# EAGLE design switchboard_eurobotics2010_r2 (EAGLE 4.16)
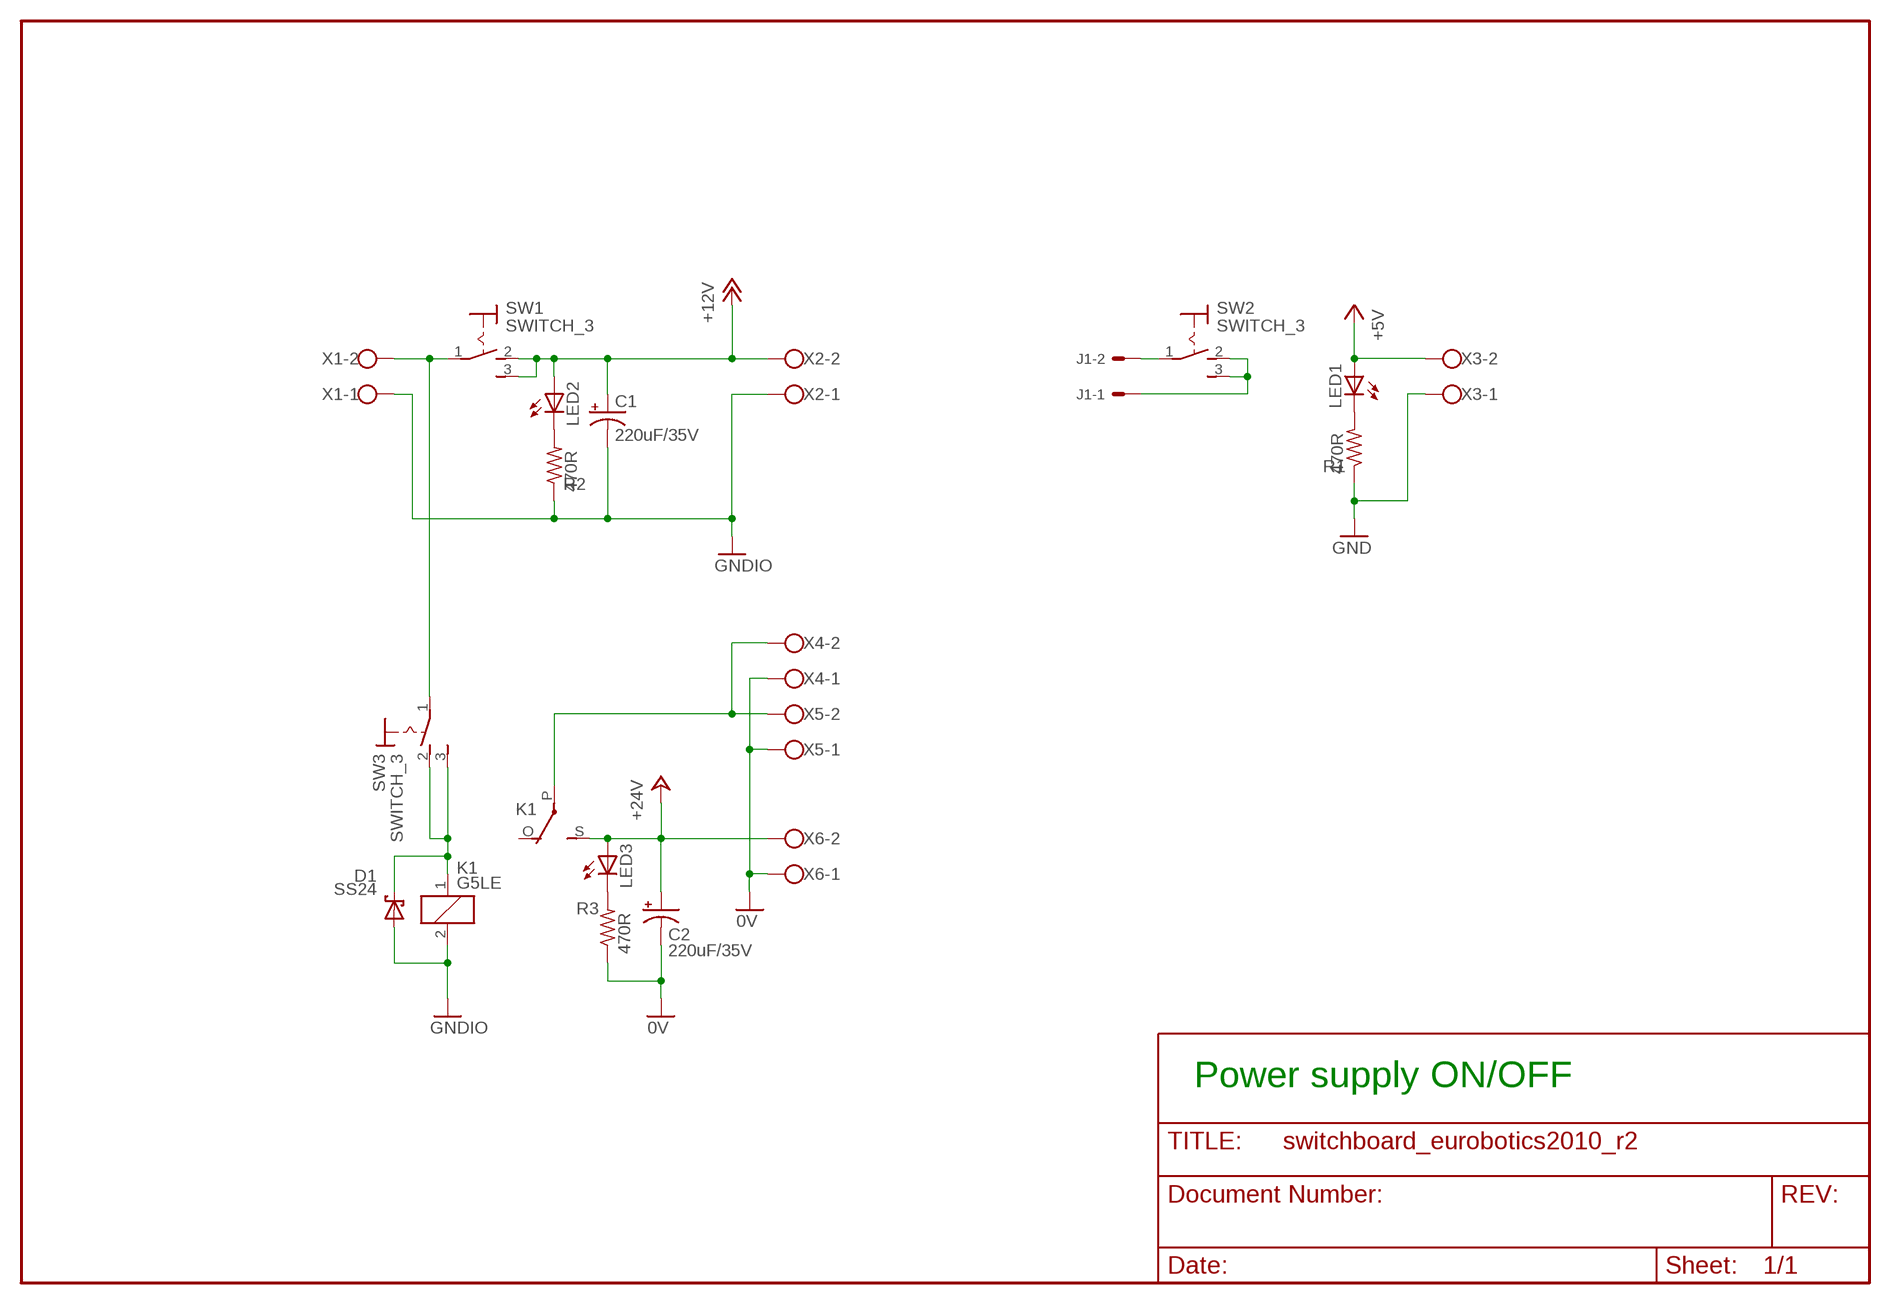
[diagram p0: schematic, sheet 1]

## Parts
C1  220uF/35V  CPOL-USE5-10.5  [E5-10,5]
C2  220uF/35V  CPOL-USE5-10.5  [E5-10,5]
D1  SS24  SCHOTTKY_SMB  [DIOM5436X265N]
J1  22-27-2021-02  [6410-02]
K1  G5LE  [G5LE]
LED1  LED3MM  [LED3MM]
LED2  LED3MM  [LED3MM]
LED3  LED3MM  [LED3MM]
R1  470R  R-US_R0805  [R0805]
R2  470R  R-US_R0805  [R0805]
R3  470R  R-US_R0805  [R0805]
SW1  SWITCH_3  [ROCKER_SWITCH]
SW2  SWITCH_3  [ROCKER_SWITCH]
SW3  SWITCH_3  [ROCKER_SWITCH]
X1  W237-02P  [W237-132]
X2  W237-02P  [W237-132]
X3  W237-02P  [W237-132]
X4  W237-02P  [W237-132]
X5  W237-02P  [W237-132]
X6  W237-02P  [W237-132]

## Nets
0V: C2.- R3.1 X4.1 X5.1 X6.1
+5V: LED1.A X3.2
+12V: C1.+ LED2.A SW1.2 SW1.3 X2.2
+24V: C2.+ K1.S(2:S) LED3.A X6.2
+24VIN: K1.P(2:P) X4.2 X5.2
GND: R1.1 X3.1
GNDIO: C1.- D1.A K1.2 R2.1 X1.1 X2.1
N$1: SW1.1 SW3.1 X1.2
N$2: J1.2 SW2.1
N$3: D1.K K1.1 SW3.2 SW3.3
N$4: J1.1 SW2.2 SW2.3
N$6: LED2.K(C) R2.2
N$7: LED1.K(C) R1.2
N$8: LED3.K(C) R3.2
Unconnected: K1.O(2:O)

## Notes on the sheet
- Power supply ON/OFF

## Library data of the parts
C1 C2 = rcl:CPOL-US: POLARIZED CAPACITOR, American symbol
D1 = ipc-7351-diode:SCHOTTKY_
J1 = con-molex:22-?-02: CONNECTOR wire to board 2.54 mm (.1 inch) pitch header
K1 = relay:G5LE: RELAY 1 x switch, 10 A/120 V AC, 8 A/30 V DC, Omron
LED1-LED3 = led:LED: LED OSRAM: - CHIPLED LG R971, LG N971, LY N971, LG Q971, LY Q971, LO R971, LY R971 LH N974, LH R974 LS Q976, LO Q976, LY Q976 LO Q996 - Hyper CHIPLED LW Q18S LB Q993, LB Q99A, LB R99A - SideLED LS A670, LO A670, LY A670, LG A670, LP A670 LB A673, LV A673, LT A673, LW A673 LH A674 LY A675 LS A676, LA A676, LO A676, LY A676, LW A676 LS A679, LY A679, LG A679 - Hyper Micro SIDELED® LS Y876, LA Y876, LO Y876, LY Y876 LT Y87S - SmartLED LW L88C, LW L88S LB L89C, LB L89S, LG L890 LS L89K, LO L89K, LY L89K LS L896, LA L896, LO L896, LY L896 - TOPLED LS T670, LO T670, LY T670, LG T670, LP T670 LSG T670, LSP T670, LSY T670, LOP T670, LYG T670 LG T671, LOG T671, LSG T671 LB T673, LV T673, LT T673, LW T673 LH T674 LS T676, LA T676, LO T676, LY T676, LB T676, LH T676, LSB T676, LW T676 LB T67C, LV T67C, LT T67C, LS T67K, LO T67K, LY T67K, LW E67C LS E67B, LA E67B, LO E67B, LY E67B, LB E67C, LV E67C, LT E67C LW T67C LS T679, LY T679, LG T679 LS T770, LO T770, LY T770, LG T770, LP T770 LB T773, LV T773, LT T773, LW T773 LH T774 LS E675, LA E675, LY E675, LS T675 LS T776, LA T776, LO T776, LY T776, LB T776 LHGB T686 LT T68C, LB T68C - Hyper Mini TOPLED® LB M676 - Mini TOPLED Santana® LG M470 LS M47K, LO M47K, LY M47K Source: http://www.osram.convergy.de/
R1-R3 = rcl:R-US_: RESISTOR, American symbol
SW1-SW3 = temp_eagle_lib:SWITCH_3
X1-X6 = con-wago-508:W237-02P: WAGO SREW CLAMP

## Board
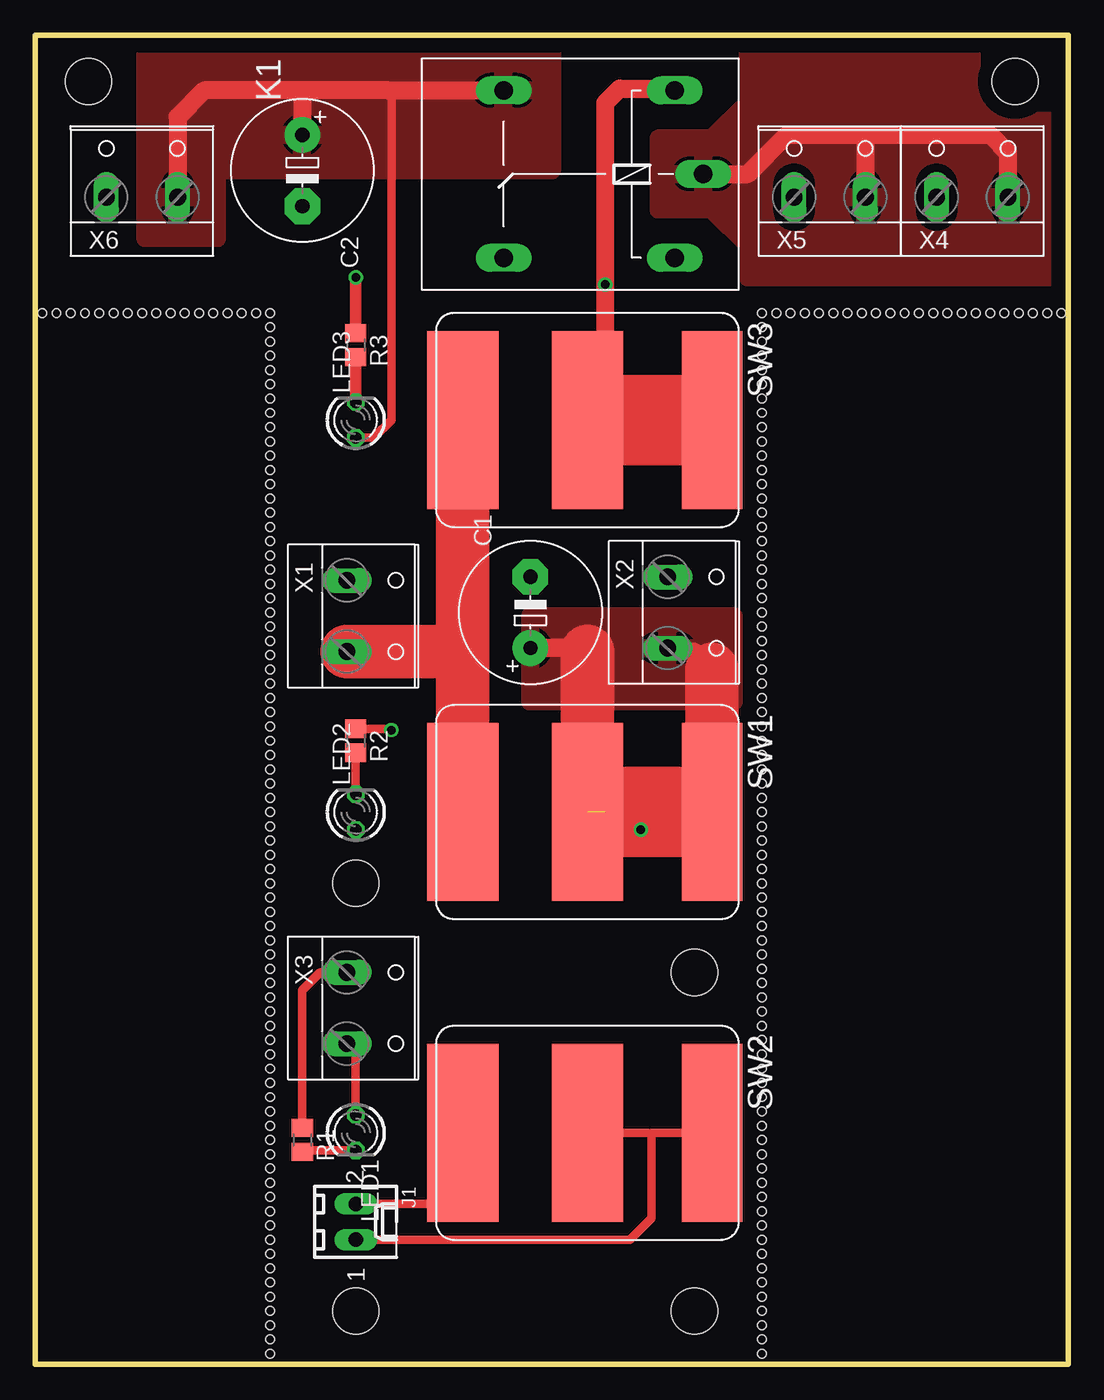
[diagram p1: board, top side]
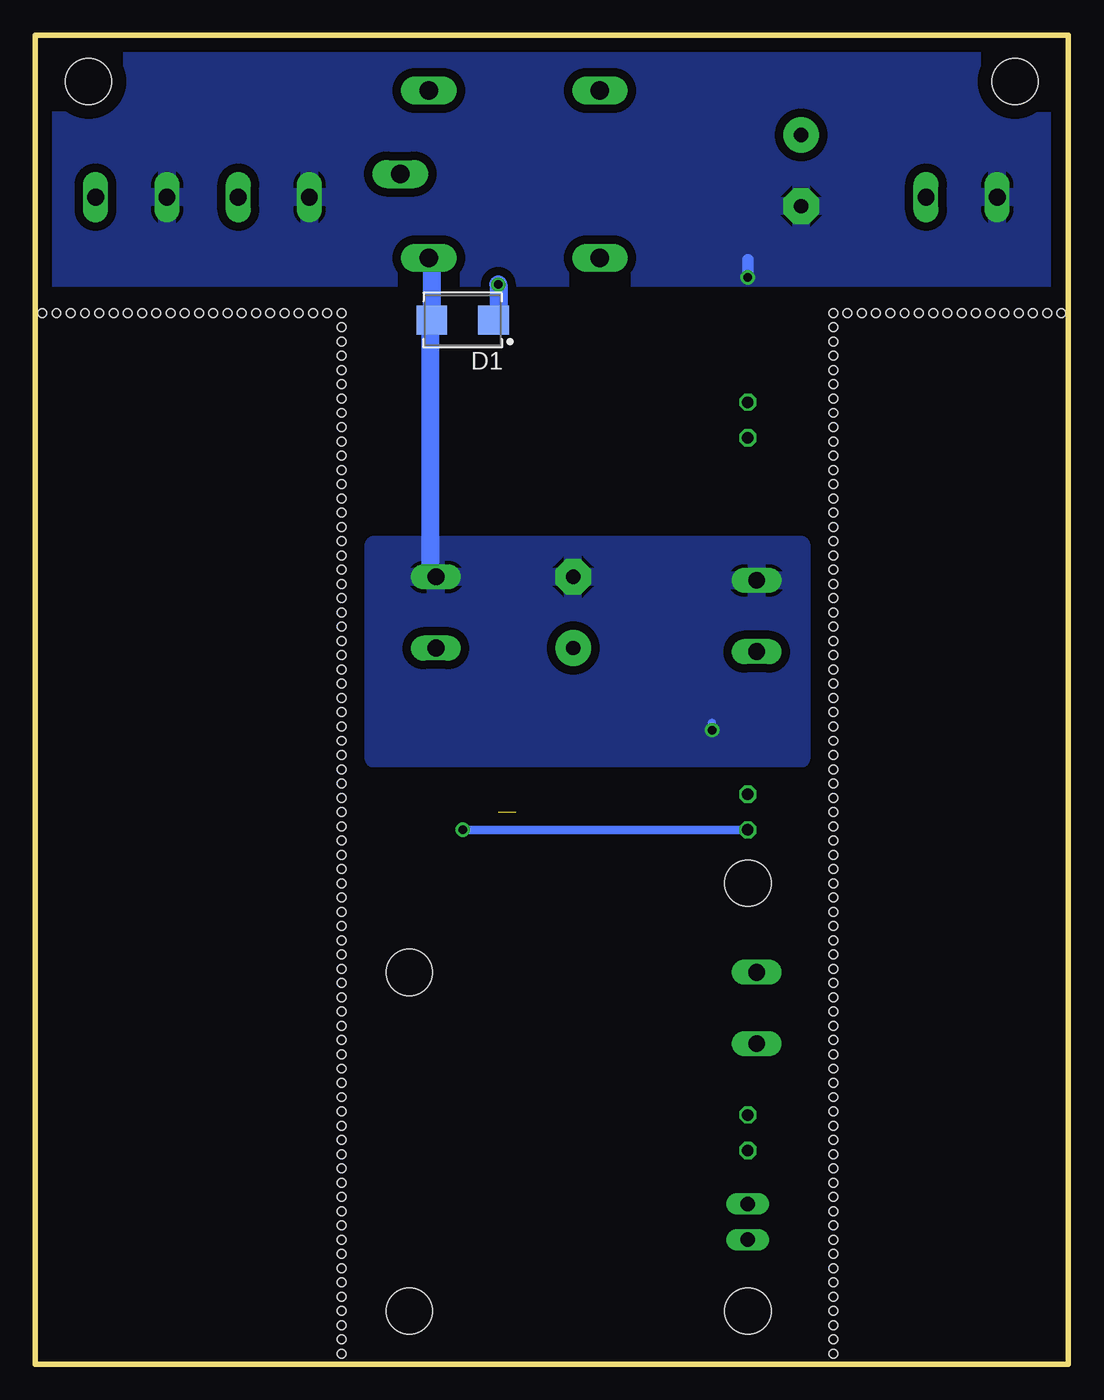
[diagram p2: board, bottom side, seen from below]

Size 73.66 x 94.74 mm. Coordinates in mm from the lower left corner, seen from the top.
Outline: 0,94.74 73.66,94.74 73.66,0 0,0 0,94.74
Copper layers (1*16): Top 0.035mm / dielectric 1.5mm / Bottom 0.035mm
Design rules "olimex": minimum track width 10mil, minimum drill 24mil, track to track 8mil, track to pad 8mil, pad to pad 8mil, via to via 8mil, smd to smd 8mil, copper to edge 40mil, drill to drill 8mil, minimum pad ring 8mil, minimum via ring 8mil, stop-mask expansion 4mil, vias tented up to drill 0mil, thermal gap 10mil
Holes 3.3 mm at 69.85,91.44 3.81,91.44 22.86,34.29 46.99,3.81 46.99,27.94 22.86,3.81
Holes 0.61 mm at 2.54,74.93 3.56,74.93 4.57,74.93 5.59,74.93 6.6,74.93 7.62,74.93 8.64,74.93 9.65,74.93 10.67,74.93 11.68,74.93 12.7,74.93 13.72,74.93 14.73,74.93 15.75,74.93 16.76,74.93 16.76,73.91 16.76,72.9 1.52,74.93 16.76,71.88 73.15,74.93 72.14,74.93 71.12,74.93 70.1,74.93 69.09,74.93 68.07,74.93 67.06,74.93 66.04,74.93 65.02,74.93 16.76,60.71 16.76,61.72 16.76,62.74 16.76,63.75 16.76,64.77 16.76,65.79 16.76,66.8 16.76,67.82 16.76,68.83 16.76,69.85 16.76,70.87 16.76,59.69 16.76,48.51 16.76,49.53 16.76,50.55 16.76,51.56 16.76,52.58 16.76,53.59 16.76,54.61 16.76,55.63 16.76,56.64 16.76,57.66 16.76,58.67 16.76,47.5 16.76,36.32 16.76,37.34 16.76,38.35 16.76,39.37 16.76,40.39 16.76,41.4 16.76,42.42 16.76,43.43 16.76,44.45 16.76,45.47 16.76,46.48 16.76,35.31 16.76,24.13 16.76,25.15 16.76,26.16 16.76,27.18 16.76,28.19 16.76,29.21 16.76,30.23 16.76,31.24 16.76,32.26 16.76,33.27 16.76,34.29 16.76,23.11 16.76,11.94 16.76,12.95 16.76,13.97 16.76,14.99 16.76,16 16.76,17.02 16.76,18.03 16.76,19.05 16.76,20.07 16.76,21.08 16.76,22.1 16.76,10.92 16.76,0.76 16.76,1.78 16.76,2.79 16.76,3.81 16.76,4.83 16.76,5.84 16.76,6.86 16.76,7.87 16.76,8.89 16.76,9.91 51.82,74.93 51.82,73.91 51.82,72.9 51.82,71.88 51.82,60.71 51.82,61.72 51.82,62.74 51.82,63.75 51.82,64.77 51.82,65.79 51.82,66.8 51.82,67.82 51.82,68.83 51.82,69.85 51.82,70.87 51.82,59.69 51.82,48.51 51.82,49.53 51.82,50.55 51.82,51.56 51.82,52.58 51.82,53.59 51.82,54.61 51.82,55.63 51.82,56.64 51.82,57.66 51.82,58.67 51.82,47.5 51.82,36.32 51.82,37.34 51.82,38.35 51.82,39.37 51.82,40.39 51.82,41.4 51.82,42.42 51.82,43.43 51.82,44.45 51.82,45.47 51.82,46.48 51.82,35.31 51.82,24.13 51.82,25.15 51.82,26.16 51.82,27.18 51.82,28.19 51.82,29.21 51.82,30.23 51.82,31.24 51.82,32.26 51.82,33.27 51.82,34.29 51.82,23.11 51.82,11.94 51.82,12.95 51.82,13.97 51.82,14.99 51.82,16 51.82,17.02 51.82,18.03 51.82,19.05 51.82,20.07 51.82,21.08 51.82,22.1 51.82,10.92 51.82,0.76 51.82,1.78 51.82,2.79 51.82,3.81 51.82,4.83 51.82,5.84 51.82,6.86 51.82,7.87 51.82,8.89 51.82,9.91 0.51,74.93 62.99,74.93 61.98,74.93 60.96,74.93 59.94,74.93 58.93,74.93 57.91,74.93 56.9,74.93 55.88,74.93 54.86,74.93 53.85,74.93 52.83,74.93 64.01,74.93

### Footprints (pad centres in the part's own frame; a part is rotated, then mirrored left to right if it is on the bottom)
E5-10,5 = drill 1.016 pad 2.54 round: + -2.54,0 | drill 1.016 pad 2.54 octagon: - 2.54,0
DIOM5436X265N = smd 2.2 x 2.05: A 2.2,0; K -2.2,0
6410-02 = drill 1.016 long: 1 1.27,0; 2 -1.27,0
G5LE = drill 1.321 long: 1 -7.493,-5.969; 2 -7.493,5.969; O 4.699,5.969; P -9.525,0; S 4.699,-5.969
LED3MM = drill 0.813 octagon: A -1.27,0; K 1.27,0
R0805 = smd 1.3 x 1.5: 1 -0.85,0; 2 0.85,0
ROCKER_SWITCH = smd 12.7 x 5.08: 1 0,-8.89; 2 0,0 | smd 12.7 x 4.318: 3 0,8.89
W237-132 = drill 1.194 long: 1 -2.54,-0.635; 2 2.54,-0.635

### Placement (x,y rotation side)
C1  35.31,53.59 90 top
C2  19.05,85.09 270 top
D1  43.18,74.42 180 bottom
J1  22.86,10.16 270 top
K1  38.1,84.84 180 top
LED1  22.86,16.51 270 top
LED2  22.86,39.37 90 top
LED3  22.86,67.31 90 top
R1  19.05,16 270 top
R2  22.86,44.45 270 top
R3  22.86,72.64 270 top
SW1  39.37,39.37 270 top
SW2  39.37,16.51 270 top
SW3  39.37,67.31 270 top
X1  22.86,53.34 270 top
X2  45.72,53.59 270 top
X3  22.86,25.4 270 top
X4  66.8,83.82 0 top
X5  56.64,83.82 0 top
X6  7.62,83.82 0 top

### Tracks (layer width: path | path; a pad name or v marks a point on that pad's centre or on a via)
0V  (via drill 0.61)
  Top 0.813: R3.1 v22.86,77.47
  Bottom 0.813: v22.86,77.47 22.86,78.74
  pour Bottom (isolate 0.61): 74.93,77.47 -1.27,77.47 -1.27,96.52 74.93,96.52
+5V
  Top 0.61: LED1.A 22.86,22.86 X3.2 22.1,22.86
+12V  (via drill 0.61)  (1 unrouted)
  Top 0.61: v43.18,38.1 43.18,39.37
  Top 1.27: 48.26,49.53 46.99,50.8 | 46.99,39.37 SW1.3 | C1.+ 39.12,51.05 39.37,50.8
  Top 3.81: SW1.3 48.26,49.53 | 39.37,40.64 39.37,50.8
  Top 6.452: 40.64,39.37 43.18,39.37 46.99,39.37
  Bottom 0.61: LED2.A v43.18,38.1
  pour Top (isolate 0.61): 35.31,53.34 49.78,53.34 49.78,47.24 35.31,47.24
+24V
  Top 0.61: LED3.A 24.13,66.04 25.4,67.31 25.4,90.93 25.15,91.19 25.15,90.81
  Top 1.27: 19.05,90.81 12.06,90.81 10.16,88.9 10.16,82.55 | 19.05,90.81 25.15,90.81 K1.S | 19.05,90.81 C2.+
  pour Top (isolate 0.61): 36.83,97.79 36.83,85.09 12.95,85.09 12.95,80.26 7.87,80.26 7.87,97.79
+24VIN
  Top 1.27: X4.2 69.34,86.36 68.07,87.63 59.18,87.63 | 59.18,87.63 53.59,87.63 50.8,84.84 K1.P 46.99,84.84 | 59.18,87.63 X5.2
  pour Top (isolate 0.61): 44.45,82.3 44.45,87.38 48.26,87.38 50.8,89.92 50.8,96.52 74.93,96.52 74.93,77.47 50.8,77.47 50.8,79.76 48.26,82.3
GND
  Top 0.61: R1.1 19.05,26.67 20.32,27.94 X3.1
GNDIO  (via drill 0.61)
  Top 0.61: R2.1 25.31,45.3 v25.4,45.21
  Bottom 0.61: v25.4,45.21 25.4,45.72
  Bottom 1.27: 45.34,78.87 45.21,78.99 | 45.34,78.87 K1.2 | 45.34,78.87 45.38,78.83 D1.A 45.38,74.59 45.47,74.68 45.47,56.13 45.21,56.13 45.09,56.01
  pour Bottom (isolate 0.61): 19.05,43.18 49.53,43.18 49.53,58.42 19.05,58.42
N$1
  Top 3.81: 30.48,50.8 X1.2 | SW1.1 30.48,50.8 | 30.48,50.8 SW3.1
N$2
  Top 0.61: J1.2 30.48,11.43
  Top 1.27: 30.48,11.43 SW2.1
N$3  (via drill 0.61)
  Top 1.27: 41.91,67.31 41.91,67.82 40.64,67.82 | 40.64,67.82 v40.64,76.96 40.64,89.92 41.66,90.93 45.47,90.93 K1.1 | 40.64,67.82 40.64,67.31 SW3.2 | 46.99,67.31 SW3.3
  Top 6.452: 41.91,67.31 46.99,67.31
  Bottom 1.27: D1.K 40.64,74.42 v40.64,76.96
N$4
  Top 0.61: J1.1 42.42,8.89 43.94,10.41 43.94,16.26 43.81,16.38 | 43.81,16.38 43.69,16.51 SW2.2 | 43.81,16.38 43.94,16.51 SW2.3
N$6
  Top 0.61: 22.86,43.69 R2.2 LED2.K
N$7
  Top 0.61: R1.2 19.05,15.24 LED1.K
N$8
  Top 0.813: LED3.K R3.2